# EAGLE design board (EAGLE 7.7.0)
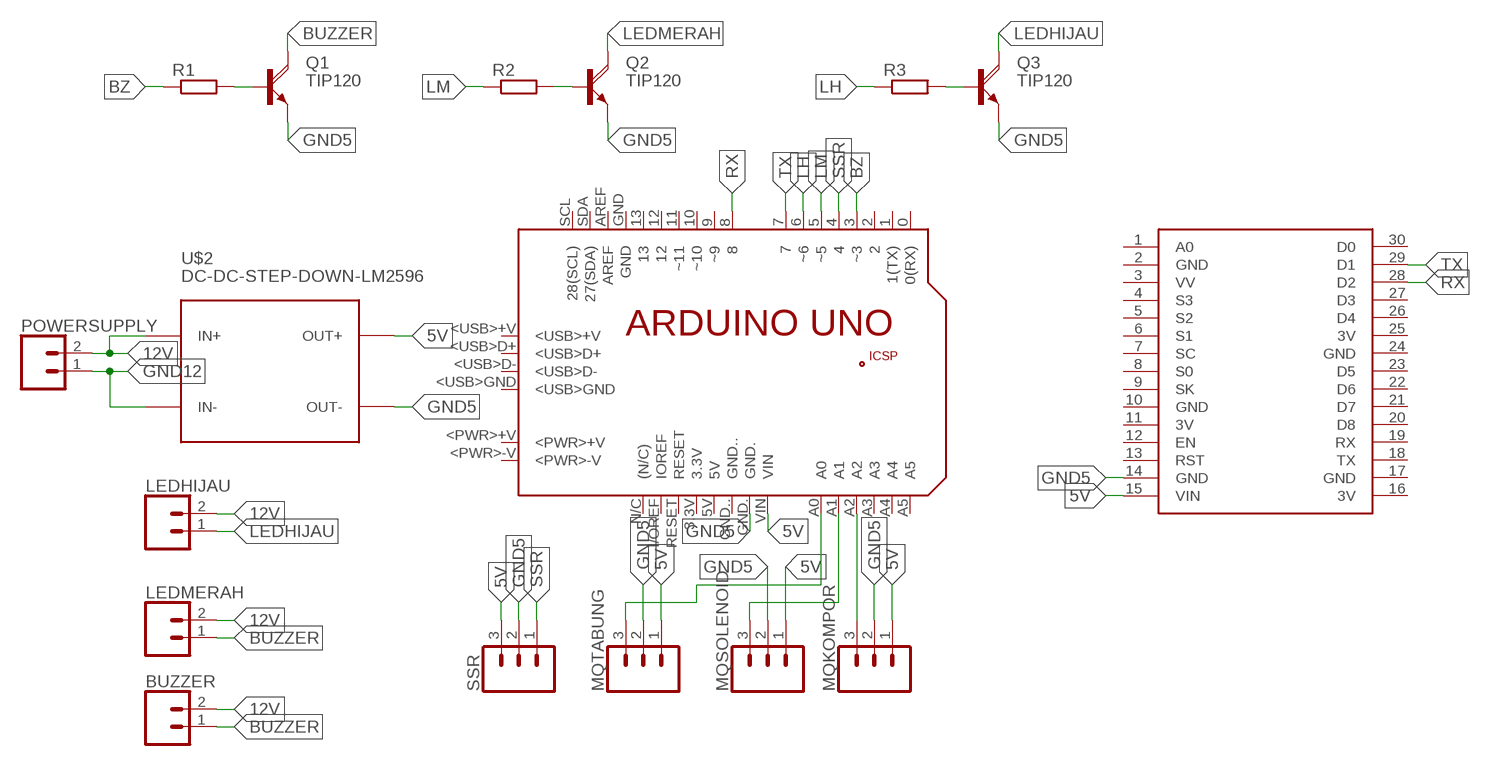
[diagram p0: schematic, sheet 1]

## Parts
BUZZER  CONN_02  [1X02]
LEDHIJAU  CONN_02  [1X02]
LEDMERAH  CONN_02  [1X02]
MQKOMPOR  CONN_03  [1X03]
MQSOLENOID  CONN_03  [1X03]
MQTABUNG  CONN_03  [1X03]
PCB2  ARDUINO_UNO  [ARDUINO_UNO]
POWERSUPPLY  CONN_02  [1X02]
Q1  TIP120  [TO220AH]
Q2  TIP120  [TO220AH]
Q3  TIP120  [TO220AH]
R1  R-EU_0207/10  [0207/10]
R2  R-EU_0207/10  [0207/10]
R3  R-EU_0207/10  [0207/10]
SSR  CONN_03  [1X03]
U$1  NODEMCU  [NODEMCU]
U$2  DC-DC-STEP-DOWN-LM2596  [DC-DC-STEP-DOWN-LM2596]

## Nets
5V: MQKOMPOR.1 MQSOLENOID.1 MQTABUNG.1 PCB2.VIN SSR.3 U$1.15(VIN) U$2.OUT+
12V: BUZZER.2 LEDHIJAU.2 LEDMERAH.2 POWERSUPPLY.2 U$2.IN+
BUZZER: BUZZER.1 LEDMERAH.1 Q1.C
BZ: PCB2.3(~3) R1.1
GND5: MQKOMPOR.2 MQSOLENOID.2 MQTABUNG.2 PCB2.GND. Q1.E Q2.E Q3.E SSR.2 U$1.14(GND) U$2.OUT-
GND12: POWERSUPPLY.1 U$2.IN-
LEDHIJAU: LEDHIJAU.1 Q3.C
LEDMERAH: Q2.C
LH: PCB2.6(~6) R3.1
LM: PCB2.5(~5) R2.1
N$1: Q1.B R1.2
N$2: MQSOLENOID.3 PCB2.A1
N$3: MQTABUNG.3 PCB2.A0
N$4: MQKOMPOR.3 PCB2.A2
N$7: Q2.B R2.2
N$11: Q3.B R3.2
RX: PCB2.8 U$1.28(D2)
SSR: PCB2.4 SSR.1
TX: PCB2.7 U$1.29(D1)
Unconnected: PCB2.0(0(RX)) PCB2.1(1(TX)) PCB2.2 PCB2.3.3V PCB2.5V PCB2.9(~9) PCB2.10(~10) PCB2.11(~11) PCB2.12 PCB2.13 PCB2.+5V PCB2.<PWR>+V PCB2.<PWR>-V PCB2.<USB>+V PCB2.<USB>D+ PCB2.<USB>D- PCB2.<USB>GND PCB2.A3 PCB2.A4 PCB2.A5 PCB2.AREF PCB2.GND PCB2.GND.. PCB2.GND_ PCB2.I/OREF(IOREF) PCB2.MISO PCB2.MOSI PCB2.N/C((N/C)) PCB2.RESET PCB2.RESET. PCB2.SCK PCB2.SCL(28(SCL)) PCB2.SDA(27(SDA)) U$1.1(A0) U$1.3(VV) U$1.4(S3) U$1.5(S2) U$1.6(S1) U$1.7(SC) U$1.8(S0) U$1.9(SK) U$1.12(EN) U$1.13(RST) U$1.18(TX) U$1.19(RX) U$1.20(D8) U$1.21(D7) U$1.22(D6) U$1.23(D5) U$1.26(D4) U$1.27(D3) U$1.30(D0)

## Power pins joined to a net without a drawn wire
3V: U$1.11(3V) U$1.16(3V) U$1.25(3V)
GND: U$1.2(GND) U$1.10(GND) U$1.17(GND) U$1.24(GND)

## Library data of the parts
BUZZER LEDHIJAU LEDMERAH POWERSUPPLY = SparkFun-Connectors:CONN_02: Multi connection point. Often used as Generic Header-pin footprint for 0.1 inch spaced/style header connections On any of the 0.1 inch spaced packages, you can populate with these: Break Away Headers - Straight <https://www.sparkfun.com/products/116> (PRT-00116) Break Away Male Headers - Right Angle <https://www.sparkfun.com/products/553> (PRT-00553) Female Headers <https://www.sparkfun.com/products/115> (PRT-00115) Break Away Headers - Machine Pin <https://www.sparkfun.com/products/117> (PRT-00117) Break Away Female Headers - Swiss Machine Pin <https://www.sparkfun.com/products/743> (PRT-00743) For SCREWTERMINALS and SPRING TERMINALS visit here: Screw Terimnals on SparkFun.com <https://www.sparkfun.com/search/results?term=Screw+Terminals> (5mm/3.5mm/2.54mm spacing) This device is also useful as a general connection point to wire up your design to another part of your project. Our various solder wires solder well into these plated through hole pads. Hook-Up Wire - Assortment (Stranded, 22 AWG) <https://www.sparkfun.com/products/11375> (PRT-11375) Hook-Up Wire - Assortment (Solid Core, 22 AWG) <https://www.sparkfun.com/products/11367> (PRT-11367) View the entire wire category on our website here <https://www.sparkfun.com/categories/141> Special notes: Molex polarized connector foot print use with: PRT-08233 with associated crimp pins and housings. 2.54_SCREWTERM for use with PRT-10571. 3.5mm Screw Terminal footprints for PRT-08084 5mm Screw Terminal footprints for use with PRT-08432
MQKOMPOR MQSOLENOID MQTABUNG SSR = SparkFun-Connectors:CONN_03: Multi connection point. Often used as Generic Header-pin footprint for 0.1 inch spaced/style header connections On any of the 0.1 inch spaced packages, you can populate with these: Break Away Headers - Straight <https://www.sparkfun.com/products/116> (PRT-00116) Break Away Male Headers - Right Angle <https://www.sparkfun.com/products/553> (PRT-00553) Female Headers <https://www.sparkfun.com/products/115> (PRT-00115) Break Away Headers - Machine Pin <https://www.sparkfun.com/products/117> (PRT-00117) Break Away Female Headers - Swiss Machine Pin <https://www.sparkfun.com/products/743> (PRT-00743) Stackable Header - 3 Pin (Female, 0.1") <https://www.sparkfun.com/products/13875> (PRT-13875) For SCREWTERMINALS and SPRING TERMINALS visit here: Screw Terimnals on SparkFun.com <https://www.sparkfun.com/search/results?term=Screw+Terminals> (5mm/3.5mm/2.54mm spacing) This device is also useful as a general connection point to wire up your design to another part of your project. Our various solder wires solder well into these plated through hole pads. Hook-Up Wire - Assortment (Stranded, 22 AWG) <https://www.sparkfun.com/products/11375> (PRT-11375) Hook-Up Wire - Assortment (Solid Core, 22 AWG) <https://www.sparkfun.com/products/11367> (PRT-11367) View the entire wire category on our website here <https://www.sparkfun.com/categories/141> Special notes: Molex polarized connector foot print use with SKU : PRT-08232 with associated crimp pins and housings.
PCB2 = Arduino:ARDUINO_UNO: Device for representing an Arduino Uno board with a footprint in an EAGLE design. Created by Dave Young for Element14. More EAGLE documentation at: http://www.element14.com/community/community/knode/cadsoft_eagle
Q1-Q3 = transistor-power:TIP120: NPN DARLINGTON TRANSISTOR
R1-R3 = rcl:R-EU_: RESISTOR, European symbol
U$1 = nodemcu:NODEMCU
U$2 = diy-modules:DC-DC-STEP-DOWN-LM2596: DC/DC Step-Down Regulator based on LM2596-ADJ chip LM2596 datasheet available here: http://www.ti.com/lit/ds/symlink/lm2596.pdf Click here to find device on ebay.com <http://www.ebay.com/sch/lm2596+power+regulator>

## Board
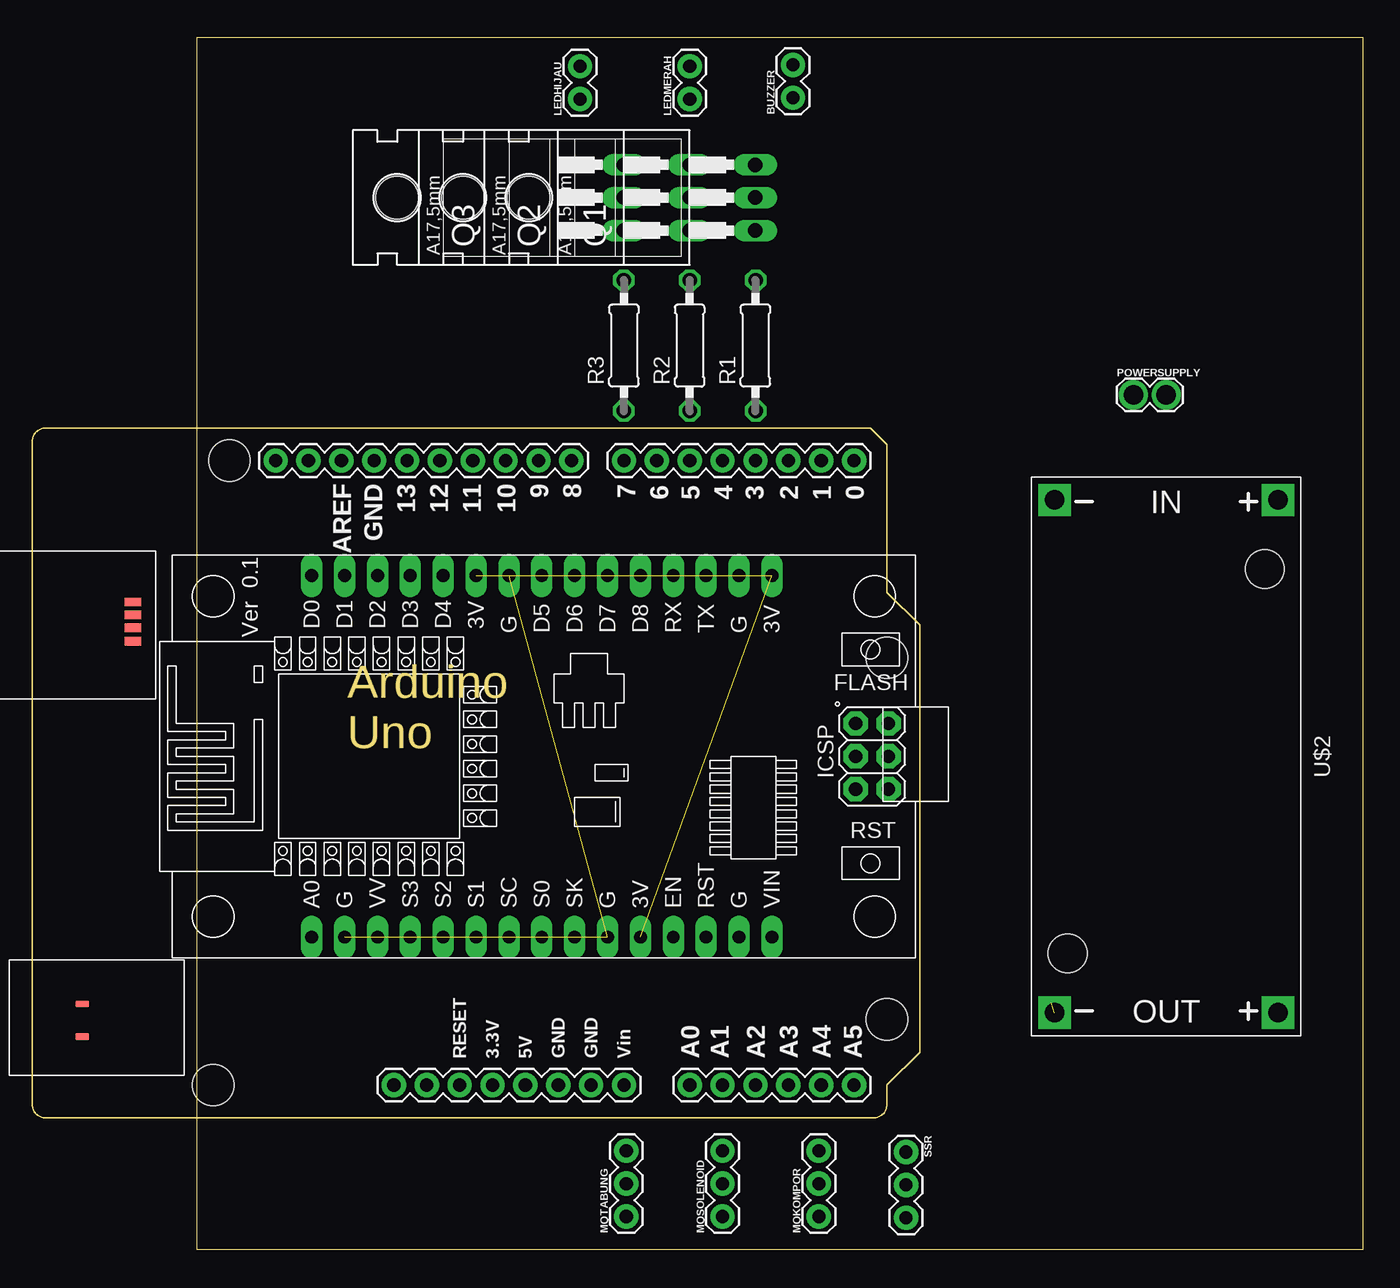
[diagram p1: board, top side]
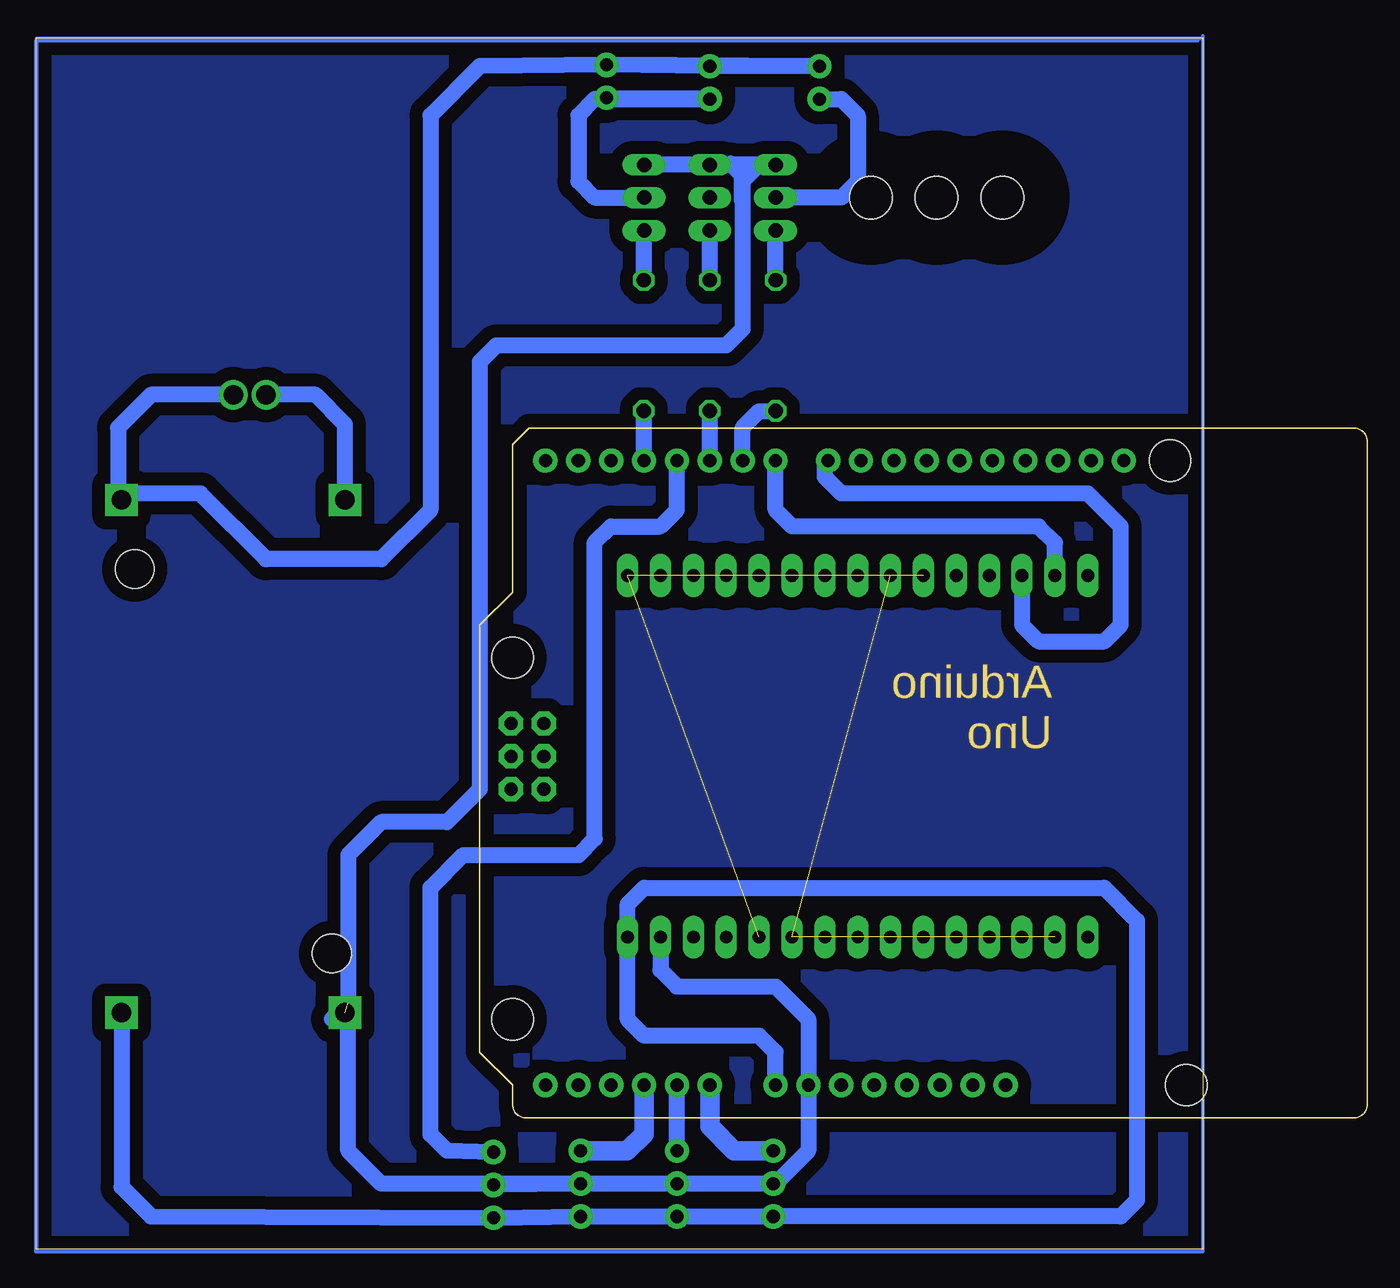
[diagram p2: board, bottom side, seen from below]

Size 90.15 x 93.65 mm. Coordinates in mm from the lower left corner, seen from the top.
Outline: 0,0 90.15,0 90.15,93.65 0,93.65 0,0
Copper layers (1*16): Top 0.035mm / dielectric 1.5mm / Bottom 0.035mm
Design rules "default": minimum track width 10mil, minimum drill 24mil, track to track 8mil, track to pad 8mil, pad to pad 8mil, via to via 8mil, smd to smd 8mil, copper to edge 40mil, drill to drill 8mil, minimum pad ring 10mil, minimum via ring 8mil, stop-mask expansion 4mil, vias tented up to drill 0mil, thermal gap 10mil

### Footprints (pad centres in the part's own frame; a part is rotated, then mirrored left to right if it is on the bottom)
1X02 = drill 1.016 pad 1.88: 1 0,0; 2 2.54,0
1X03 = drill 1.016 pad 1.88: 1 0,0; 2 2.54,0; 3 5.08,0
ARDUINO_UNO = drill 1.016 pad 1.88: 0 63.5,50.8; 1 60.96,50.8; 2 58.42,50.8; 3 55.88,50.8; 3.3V 35.56,2.54; 4 53.34,50.8; 5 50.8,50.8; 5V 38.1,2.54; 6 48.26,50.8; 7 45.72,50.8; 8 41.656,50.8; 9 39.116,50.8; 10 36.576,50.8; 11 34.036,50.8; 12 31.496,50.8; 13 28.956,50.8; A0 50.8,2.54; A1 53.34,2.54; A2 55.88,2.54; A3 58.42,2.54; A4 60.96,2.54; A5 63.5,2.54; AREF 23.876,50.8; GND 26.416,50.8; GND. 43.18,2.54; GND.. 40.64,2.54; I/OREF 30.48,2.54; N/C 27.94,2.54; RESET 33.02,2.54; SCL 18.796,50.8; SDA 21.336,50.8; VIN 45.72,2.54 | drill 1.016 pad 1.88 octagon: +5V 66.167,30.48; GND_ 66.167,25.4; MISO 63.627,30.48; MOSI 66.167,27.94; RESET. 63.627,25.4; SCK 63.627,27.94 | smd 1.016 x 0.508: <PWR>+V 3.861,8.814; <PWR>-V 3.861,6.274 | smd 1.27 x 0.635: <USB>+V 7.772,39.878; <USB>D+ 7.772,38.887; <USB>D- 7.772,37.871; <USB>GND 7.772,36.83 | hole 3.2: 66.04,7.62; 66.04,35.56; 15.24,50.8; 13.97,2.54
TO220AH = drill 1.118 long: B -2.54,-6.35; C 0,-6.35; E 2.54,-6.35 | hole 3.302: 0,11.176
0207/10 = drill 0.813 octagon: 1 -5.08,0; 2 5.08,0
NODEMCU = drill 1 pad 1.676 long: 1 -13.97,17.78; 2 -13.97,15.24; 3 -13.97,12.7; 4 -13.97,10.16; 5 -13.97,7.62; 6 -13.97,5.08; 7 -13.97,2.54; 8 -13.97,0; 9 -13.97,-2.54; 10 -13.97,-5.08; 11 -13.97,-7.62; 12 -13.97,-10.16; 13 -13.97,-12.7; 14 -13.97,-15.24; 15 -13.97,-17.78; 16 13.97,-17.78; 17 13.97,-15.24; 18 13.97,-12.7; 19 13.97,-10.16; 20 13.97,-7.62; 21 13.97,-5.08; 22 13.97,-2.54; 23 13.97,0; 24 13.97,2.54; 25 13.97,5.08; 26 13.97,7.62; 27 13.97,10.16; 28 13.97,12.7; 29 13.97,15.24; 30 13.97,17.78
DC-DC-STEP-DOWN-LM2596 = drill 1.5 pad 2.5 square: IN+ -19.812,8.636; IN- -19.812,-8.636; OUT+ 19.812,8.636; OUT- 19.812,-8.636 | hole 3: -14.478,7.62; 15.24,-7.62

### Placement (x,y rotation side)
BUZZER  46.08,89 90 top
LEDHIJAU  29.62,88.9 90 top
LEDMERAH  38.1,88.9 90 top
MQKOMPOR  48.08,2.54 90 top
MQSOLENOID  40.64,2.54 90 top
MQTABUNG  33.2,2.54 90 top
PCB2  -12.7,10.16 0 top
POWERSUPPLY  72.39,66.04 0 top
Q1  36.83,81.28 90 top
Q2  31.75,81.28 90 top
Q3  26.67,81.28 90 top
R1  43.18,69.85 90 top
R2  38.1,69.85 90 top
R3  33.02,69.85 90 top
SSR  54.82,7.52 270 top
U$1  26.67,38.1 90 top
U$2  74.93,38.1 270 top

### Tracks (layer width: path | path; a pad name or v marks a point on that pad's centre or on a via)
3V  (2 unrouted)
5V
  Bottom 1.25: U$2.OUT+ 83.57,4.83 81.28,2.54 SSR.3 MQKOMPOR.1 MQSOLENOID.1 MQTABUNG.1 6.35,2.54 5.08,3.81 5.08,25.4 7.62,27.94 43.18,27.94 44.45,26.67 U$1.15 44.45,17.78 43.18,16.51 34.29,16.51 33.02,15.24 PCB2.VIN
12V
  Bottom 1.25: POWERSUPPLY.2 81.28,66.04 83.82,63.5 83.82,58.17 U$2.IN+ 83.06,58.42 77.47,58.42 72.39,53.34 63.5,53.34 59.69,57.15 59.69,87.63 55.88,91.44 BUZZER.2 | BUZZER.2 LEDMERAH.2 LEDHIJAU.2 BUZZER.2
BUZZER
  Bottom 1.25: BUZZER.1 46.99,88.9 48.26,87.63 48.26,82.55 46.99,81.28 Q1.C
  Bottom 1.3: LEDMERAH.1 46.08,88.9 BUZZER.1
BZ
  Bottom 1.25: PCB2.3 R1.1
GND  (3 unrouted)
GND5  (1 unrouted)
  Bottom 1.25: MQTABUNG.2 33.02,5.08 30.48,7.62 PCB2.GND. 30.48,17.78 33.02,20.32 40.64,20.32 41.91,21.59 U$1.14 | MQTABUNG.2 MQSOLENOID.2 MQKOMPOR.2 SSR.2 | Q1.E Q2.E Q3.E 34.29,83.82 35.56,82.55 35.56,71.12 36.83,69.85 54.61,69.85 55.88,68.58 55.88,35.56 58.42,33.02 63.5,33.02 66.04,30.48 66.04,19.05 67.31,17.78 | MQTABUNG.2 63.5,5.08 66.04,7.62 66.04,18.03 U$2.OUT-
GND12
  Bottom 1.25: U$2.IN- 66.29,63.75 68.58,66.04 POWERSUPPLY.1
LEDHIJAU
  Bottom 1.25: LEDHIJAU.1 27.94,88.9 26.67,87.63 26.67,82.55 27.94,81.28 Q3.C
LH
  Bottom 1.25: PCB2.6 35.56,63.5 34.29,64.77 R3.1
LM
  Bottom 1.25: PCB2.5 R2.1
N$1
  Bottom 1.25: R1.2 Q1.B
N$2
  Bottom 1.25: MQSOLENOID.3 PCB2.A1
N$3
  Bottom 1.5: MQTABUNG.3 36.22,7.62 38.1,9.5 PCB2.A0
N$4
  Bottom 1.5: MQKOMPOR.3 44.48,7.62 43.2,8.9 43.2,12.68 PCB2.A2
N$5
  pour Bottom (isolate 1): 0,93.98 90.17,93.98 90.17,0 0,0
N$6  (via drill 1.5 pad 0.25)
  other vias: 72.39,66.04
N$7
  Bottom 1.25: R2.2 Q2.B
N$8  (via drill 1.5 pad 0.25)
  other vias: 74.93,66.04
N$9
  Bottom 0.254: 0,93.6 90.1,93.6 90.1,0
N$10
  Bottom 0.254: 0.4,93.4 90.2,93.4 90.2,-0.2 0,-0.2 0,93.8
N$11
  Bottom 1.25: R3.2 Q3.B
N$12
  Bottom 1.27: 35.6,81.1 35.6,83 36.5,83.9
N$13  (via drill 1.1 pad 0.41)
  other vias: 33,74.9
N$14  (via drill 1.1 pad 0.41)
  other vias: 38.1,74.9
N$15  (via drill 1.1 pad 0.41)
  other vias: 43.2,74.9
N$16  (via drill 1.1 pad 0.41)
  other vias: 33,64.8
N$17  (via drill 1.1 pad 0.41)
  other vias: 38.1,64.8
N$18  (via drill 1.1 pad 0.41)
  other vias: 43.2,64.8
RX
  Bottom 1.25: U$1.28 13.97,48.26 12.7,46.99 7.62,46.99 6.35,48.26 6.35,55.88 8.89,58.42 27.94,58.42 29.21,59.69 29.21,60.71 PCB2.8
SSR
  Bottom 1.25: SSR.1 58.42,7.62 59.69,8.89 59.69,27.94 57.15,30.48 48.26,30.48 46.99,31.75 46.99,54.61 45.72,55.88 41.91,55.88 40.64,57.15 PCB2.4
TX
  Bottom 1.25: U$1.29 11.43,54.61 12.7,55.88 31.75,55.88 33.02,57.15 PCB2.7